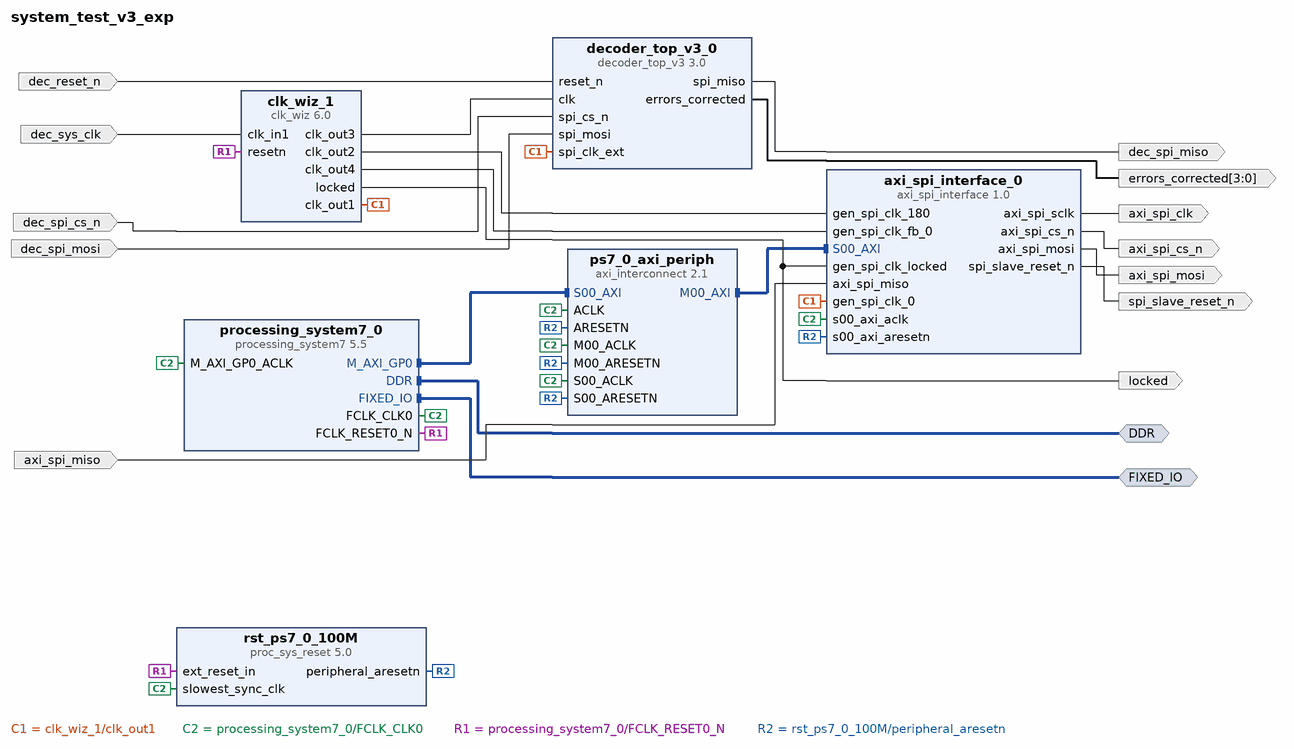
[diagram p0: block diagram of the top level]
# Vivado block design system_test_v3_exp, xc7z020clg400-1, Vivado 2022.1
create_bd_design system_test_v3_exp

create_bd_intf_port -mode Master -vlnv xilinx.com:interface:ddrx_rtl:1.0 DDR
create_bd_intf_port -mode Master -vlnv xilinx.com:display_processing_system7:fixedio_rtl:1.0 FIXED_IO
create_bd_port -dir O -type data axi_spi_cs_n
create_bd_port -dir I -type data axi_spi_miso
create_bd_port -dir O -type data axi_spi_mosi
create_bd_port -dir I -type rst dec_reset_n
create_bd_port -dir I -type data dec_spi_cs_n
create_bd_port -dir O -type data dec_spi_miso
create_bd_port -dir I -type data dec_spi_mosi
create_bd_port -dir I -type clk dec_sys_clk
set_property -dict {CONFIG.FREQ_HZ 125000000} [get_bd_ports dec_sys_clk]
create_bd_port -dir O -from 3 -to 0 -type data errors_corrected
create_bd_port -dir O -type data locked
create_bd_port -dir O -type rst spi_slave_reset_n
create_bd_port -dir O -type clk axi_spi_clk

create_bd_cell -type ip -vlnv xilinx.com:ip:clk_wiz:6.0 clk_wiz_1
set_property -dict [list \
  CONFIG.CLKIN1_JITTER_PS 80.0 \
  CONFIG.CLKOUT1_JITTER 237.312 \
  CONFIG.CLKOUT1_PHASE_ERROR 249.865 \
  CONFIG.CLKOUT1_REQUESTED_OUT_FREQ 100.000 \
  CONFIG.CLKOUT1_REQUESTED_PHASE 255.948 \
  CONFIG.CLKOUT2_JITTER 237.312 \
  CONFIG.CLKOUT2_PHASE_ERROR 249.865 \
  CONFIG.CLKOUT2_REQUESTED_OUT_FREQ 100.000 \
  CONFIG.CLKOUT2_REQUESTED_PHASE 180.000 \
  CONFIG.CLKOUT2_USED true \
  CONFIG.CLKOUT3_JITTER 237.312 \
  CONFIG.CLKOUT3_PHASE_ERROR 249.865 \
  CONFIG.CLKOUT3_REQUESTED_OUT_FREQ 100.000 \
  CONFIG.CLKOUT3_REQUESTED_PHASE 0.000 \
  CONFIG.CLKOUT3_USED true \
  CONFIG.CLKOUT4_JITTER 237.312 \
  CONFIG.CLKOUT4_PHASE_ERROR 249.865 \
  CONFIG.CLKOUT4_REQUESTED_OUT_FREQ 100.000 \
  CONFIG.CLKOUT4_REQUESTED_PHASE 334.404 \
  CONFIG.CLKOUT4_USED true \
  CONFIG.CLKOUT5_JITTER 143.688 \
  CONFIG.CLKOUT5_PHASE_ERROR 96.948 \
  CONFIG.CLKOUT5_REQUESTED_OUT_FREQ 100.000 \
  CONFIG.CLKOUT5_REQUESTED_PHASE 0.000 \
  CONFIG.CLKOUT5_USED false \
  CONFIG.CLKOUT6_JITTER 271.777 \
  CONFIG.CLKOUT6_PHASE_ERROR 249.865 \
  CONFIG.CLKOUT6_REQUESTED_OUT_FREQ 100.000 \
  CONFIG.CLKOUT6_REQUESTED_PHASE 0.000 \
  CONFIG.CLKOUT6_USED false \
  CONFIG.MMCM_CLKFBOUT_MULT_F 36.000 \
  CONFIG.MMCM_CLKIN1_PERIOD 8.000 \
  CONFIG.MMCM_CLKIN2_PERIOD 10.000 \
  CONFIG.MMCM_CLKOUT0_DIVIDE_F 9.000 \
  CONFIG.MMCM_CLKOUT0_PHASE 255.000 \
  CONFIG.MMCM_CLKOUT1_DIVIDE 9 \
  CONFIG.MMCM_CLKOUT1_PHASE 180.000 \
  CONFIG.MMCM_CLKOUT2_DIVIDE 9 \
  CONFIG.MMCM_CLKOUT2_PHASE 0.000 \
  CONFIG.MMCM_CLKOUT3_DIVIDE 9 \
  CONFIG.MMCM_CLKOUT3_PHASE 335.000 \
  CONFIG.MMCM_CLKOUT4_DIVIDE 1 \
  CONFIG.MMCM_CLKOUT4_PHASE 0.000 \
  CONFIG.MMCM_CLKOUT5_DIVIDE 1 \
  CONFIG.MMCM_CLKOUT5_PHASE 0.000 \
  CONFIG.MMCM_DIVCLK_DIVIDE 5 \
  CONFIG.NUM_OUT_CLKS 4 \
  CONFIG.PRIM_IN_FREQ 125.000 \
  CONFIG.RESET_PORT resetn \
  CONFIG.RESET_TYPE ACTIVE_LOW \
] [get_bd_cells clk_wiz_1]
create_bd_cell -type ip -vlnv xilinx.com:ip:processing_system7:5.5 processing_system7_0
set_property -dict [list \
  CONFIG.PCW_APU_PERIPHERAL_FREQMHZ 650 \
  CONFIG.PCW_CRYSTAL_PERIPHERAL_FREQMHZ 50 \
  CONFIG.PCW_ENET0_ENET0_IO {MIO 16 .. 27} \
  CONFIG.PCW_ENET0_GRP_MDIO_ENABLE 1 \
  CONFIG.PCW_ENET0_GRP_MDIO_IO {MIO 52 .. 53} \
  CONFIG.PCW_ENET0_PERIPHERAL_ENABLE 1 \
  CONFIG.PCW_ENET0_RESET_ENABLE 1 \
  CONFIG.PCW_ENET0_RESET_IO {MIO 9} \
  CONFIG.PCW_ENET_RESET_ENABLE 1 \
  CONFIG.PCW_ENET_RESET_SELECT {Share reset pin} \
  CONFIG.PCW_FPGA0_PERIPHERAL_FREQMHZ 100 \
  CONFIG.PCW_FPGA1_PERIPHERAL_FREQMHZ 50 \
  CONFIG.PCW_GPIO_MIO_GPIO_ENABLE 1 \
  CONFIG.PCW_GPIO_MIO_GPIO_IO MIO \
  CONFIG.PCW_I2C_RESET_ENABLE 1 \
  CONFIG.PCW_M_AXI_GP0_FREQMHZ 10 \
  CONFIG.PCW_PERIPHERAL_BOARD_PRESET None \
  CONFIG.PCW_PRESET_BANK1_VOLTAGE {LVCMOS 1.8V} \
  CONFIG.PCW_QSPI_GRP_FBCLK_ENABLE 1 \
  CONFIG.PCW_QSPI_GRP_FBCLK_IO {MIO 8} \
  CONFIG.PCW_QSPI_GRP_SINGLE_SS_ENABLE 1 \
  CONFIG.PCW_QSPI_GRP_SINGLE_SS_IO {MIO 1 .. 6} \
  CONFIG.PCW_QSPI_PERIPHERAL_ENABLE 1 \
  CONFIG.PCW_QSPI_QSPI_IO {MIO 1 .. 6} \
  CONFIG.PCW_SD0_GRP_CD_ENABLE 1 \
  CONFIG.PCW_SD0_GRP_CD_IO {MIO 47} \
  CONFIG.PCW_SD0_GRP_WP_ENABLE 0 \
  CONFIG.PCW_SD0_PERIPHERAL_ENABLE 1 \
  CONFIG.PCW_SD0_SD0_IO {MIO 40 .. 45} \
  CONFIG.PCW_SDIO_PERIPHERAL_FREQMHZ 50 \
  CONFIG.PCW_SINGLE_QSPI_DATA_MODE x4 \
  CONFIG.PCW_UART0_PERIPHERAL_ENABLE 1 \
  CONFIG.PCW_UART0_UART0_IO {MIO 14 .. 15} \
  CONFIG.PCW_UART1_PERIPHERAL_ENABLE 0 \
  CONFIG.PCW_UART_PERIPHERAL_FREQMHZ 100 \
  CONFIG.PCW_UIPARAM_DDR_BUS_WIDTH {16 Bit} \
  CONFIG.PCW_UIPARAM_DDR_FREQ_MHZ 525 \
  CONFIG.PCW_UIPARAM_DDR_PARTNO {MT41J256M16 RE-125} \
  CONFIG.PCW_USB0_PERIPHERAL_ENABLE 1 \
  CONFIG.PCW_USB0_RESET_ENABLE 1 \
  CONFIG.PCW_USB0_RESET_IO {MIO 46} \
  CONFIG.PCW_USB0_USB0_IO {MIO 28 .. 39} \
  CONFIG.PCW_USB_RESET_ENABLE 1 \
  CONFIG.PCW_USB_RESET_SELECT {Share reset pin} \
] [get_bd_cells processing_system7_0]
# 497 more settings of processing_system7_0 are not shown: defaults, MIO pin electricals, DDR timing, and values the tool derives
create_bd_cell -type ip -vlnv xilinx.com:ip:axi_interconnect:2.1 ps7_0_axi_periph
set_property -dict {CONFIG.NUM_MI 1} [get_bd_cells ps7_0_axi_periph]
create_bd_cell -type ip -vlnv xilinx.com:ip:proc_sys_reset:5.0 rst_ps7_0_100M
create_bd_cell -type ip -vlnv xilinx.com:user:axi_spi_interface:1.0 axi_spi_interface_0
set_property -dict [list \
  CONFIG.SPI_CLK_FB_DELAY_WIDTH 4 \
  CONFIG.SPI_EXIT_INTERVAL 1 \
  CONFIG.SPI_INIT_INTERVAL 2 \
] [get_bd_cells axi_spi_interface_0]
create_bd_cell -type ip -vlnv xilinx.com:user:decoder_top_v3:3.0 decoder_top_v3_0
set_property -dict {CONFIG.COMMS_DEBUG true CONFIG.SHIFT_OUT_COMP 0} [get_bd_cells decoder_top_v3_0]

# ---- connections ----

connect_bd_intf_net [get_bd_intf_ports DDR] [get_bd_intf_pins processing_system7_0/DDR]
connect_bd_intf_net [get_bd_intf_ports FIXED_IO] [get_bd_intf_pins processing_system7_0/FIXED_IO]
connect_bd_intf_net [get_bd_intf_pins processing_system7_0/M_AXI_GP0] [get_bd_intf_pins ps7_0_axi_periph/S00_AXI]
connect_bd_intf_net [get_bd_intf_pins ps7_0_axi_periph/M00_AXI] [get_bd_intf_pins axi_spi_interface_0/S00_AXI]
connect_bd_net [get_bd_pins axi_spi_interface_0/axi_spi_cs_n] [get_bd_ports axi_spi_cs_n]
connect_bd_net [get_bd_pins axi_spi_interface_0/axi_spi_mosi] [get_bd_ports axi_spi_mosi]
connect_bd_net [get_bd_pins axi_spi_interface_0/axi_spi_sclk] [get_bd_ports axi_spi_clk]
connect_bd_net [get_bd_pins axi_spi_interface_0/spi_slave_reset_n] [get_bd_ports spi_slave_reset_n]
connect_bd_net [get_bd_ports axi_spi_miso] [get_bd_pins axi_spi_interface_0/axi_spi_miso]
connect_bd_net [get_bd_pins clk_wiz_1/clk_out1] [get_bd_pins axi_spi_interface_0/gen_spi_clk_0] [get_bd_pins decoder_top_v3_0/spi_clk_ext]
connect_bd_net [get_bd_pins clk_wiz_1/clk_out2] [get_bd_pins axi_spi_interface_0/gen_spi_clk_180]
connect_bd_net [get_bd_pins clk_wiz_1/clk_out3] [get_bd_pins decoder_top_v3_0/clk]
connect_bd_net [get_bd_pins clk_wiz_1/clk_out4] [get_bd_pins axi_spi_interface_0/gen_spi_clk_fb_0]
connect_bd_net [get_bd_pins clk_wiz_1/locked] [get_bd_ports locked] [get_bd_pins axi_spi_interface_0/gen_spi_clk_locked]
connect_bd_net [get_bd_ports dec_reset_n] [get_bd_pins decoder_top_v3_0/reset_n]
connect_bd_net [get_bd_ports dec_spi_cs_n] [get_bd_pins decoder_top_v3_0/spi_cs_n]
connect_bd_net [get_bd_ports dec_spi_mosi] [get_bd_pins decoder_top_v3_0/spi_mosi]
connect_bd_net [get_bd_ports dec_sys_clk] [get_bd_pins clk_wiz_1/clk_in1]
connect_bd_net [get_bd_pins decoder_top_v3_0/errors_corrected] [get_bd_ports errors_corrected]
connect_bd_net [get_bd_pins decoder_top_v3_0/spi_miso] [get_bd_ports dec_spi_miso]
connect_bd_net [get_bd_pins processing_system7_0/FCLK_CLK0] \
  [get_bd_pins processing_system7_0/M_AXI_GP0_ACLK] [get_bd_pins ps7_0_axi_periph/ACLK] \
  [get_bd_pins ps7_0_axi_periph/S00_ACLK] [get_bd_pins ps7_0_axi_periph/M00_ACLK] \
  [get_bd_pins rst_ps7_0_100M/slowest_sync_clk] [get_bd_pins axi_spi_interface_0/s00_axi_aclk]
connect_bd_net [get_bd_pins processing_system7_0/FCLK_RESET0_N] [get_bd_pins clk_wiz_1/resetn] [get_bd_pins rst_ps7_0_100M/ext_reset_in]
connect_bd_net [get_bd_pins rst_ps7_0_100M/peripheral_aresetn] \
  [get_bd_pins ps7_0_axi_periph/ARESETN] [get_bd_pins ps7_0_axi_periph/S00_ARESETN] \
  [get_bd_pins ps7_0_axi_periph/M00_ARESETN] [get_bd_pins axi_spi_interface_0/s00_axi_aresetn]

# ---- address map ----
assign_bd_address -offset 0x43C00000 -range 64K -target_address_space [get_bd_addr_spaces processing_system7_0/Data] [get_bd_addr_segs axi_spi_interface_0/S00_AXI/S00_AXI_reg]

validate_bd_design
save_bd_design
